# EAGLE design RC_Transmitter_TX_FINAL_v43 (EAGLE 9.6.2)
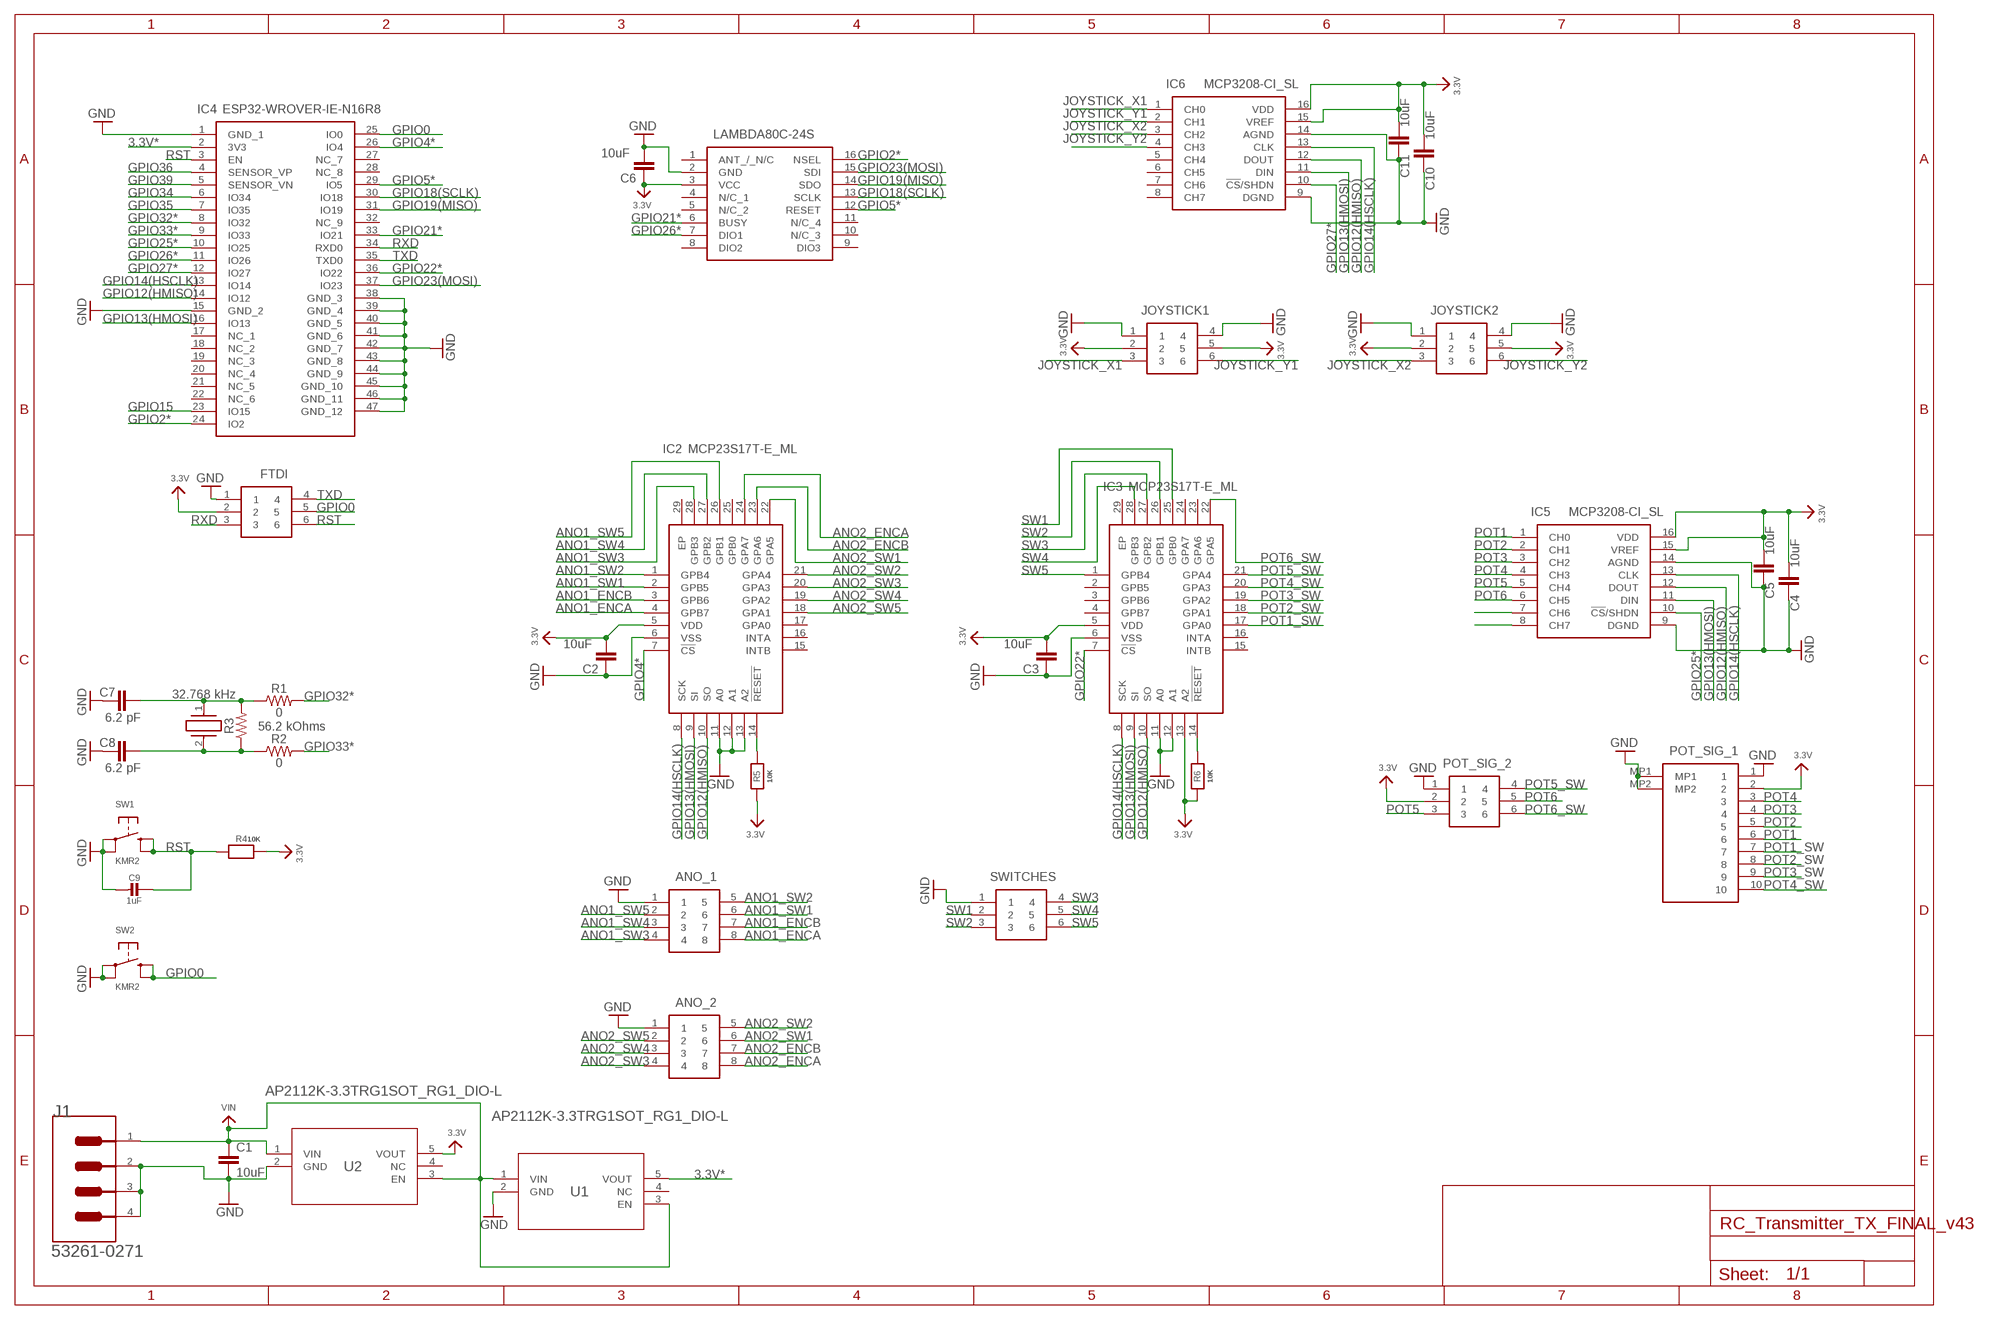
[diagram p0: schematic, sheet 1]

## Parts
ANO_1  0532610871  [53261-0871]
ANO_2  0532610871  [53261-0871]
C1  10uF  10UF-0805-10V-10%  [0805]
C2  10uF  10UF-0805-10V-10%  [0805]
C3  10uF  10UF-0805-10V-10%  [0805]
C4  10uF  10UF-0805-10V-10%  [0805]
C5  10uF  10UF-0805-10V-10%  [0805]
C6  10uF  10UF-0805-10V-10%  [0805]
C7  6.2 pF  C_CHIP-0805(2012-METRIC)  [CAPC2012X110]
C8  6.2 pF  C_CHIP-0805(2012-METRIC)  [CAPC2012X110]
C9  1uF  CAP_CERAMIC0805-NOOUTLINE  [0805-NO]
C10  10uF  10UF-0805-10V-10%  [0805]
C11  10uF  10UF-0805-10V-10%  [0805]
CRYSTAL  32.768 kHz  ECX-.327-CDX-1293  [ECX327CDX1293]
FTDI  0532610671  [0532610671]
IC1  LAMBDA80C-24S  [LAMBDA80C24S]
IC2  MCP23S17T-E_ML  [QFN65P600X600X100-29N]
IC3  MCP23S17T-E_ML  [QFN65P600X600X100-29N]
IC4  ESP32-WROVER-IE-N16R8  [ESP32WROVERIEN16R8]
IC5  MCP3208-CI_SL  [SOIC127P600X175-16N]
IC6  MCP3208-CI_SL  [SOIC127P600X175-16N]
J1  MOLEX_53261-0271MOLEX_53261-0271_0_0  [MOLEX_53261-0271_0]
JOYSTICK1  0532610671  [0532610671]
JOYSTICK2  0532610671  [0532610671]
POT_SIG_1  0532611071  [0532611071]
POT_SIG_2  0532610671  [0532610671]
R1  0  0OHM-0603-1/10W-5%  [0603]
R2  0  0OHM-0603-1/10W-5%  [0603]
R3  56.2 kOhms  0OHM-0603-1/10W-5%  [0603]
R4  10K  RESISTOR_0805  [_0805]
R5  10K  RESISTOR_0805  [_0805]
R6  10K  RESISTOR_0805  [_0805]
SW1  KMR2  SWITCH_TACT_SMT4.6X2.8  [BTN_KMR2_4.6X2.8]
SW2  KMR2  SWITCH_TACT_SMT4.6X2.8  [BTN_KMR2_4.6X2.8]
SWITCHES  0532610671  [0532610671]
U1  AP2112K-3.3TRG1SOT_RG1_DIO-L  [SOT_RG1_DIO-L]
U2  AP2112K-3.3TRG1SOT_RG1_DIO-L  [SOT_RG1_DIO-L]

## Nets
3.3V: C2.2 C3.2 C4.2 C5.2 C6.1 C10.2 C11.2 FTDI.2 IC1.3(VCC) IC2.5(VDD) IC3.5(VDD) IC3.13(A2) IC5.15(VREF) IC5.16(VDD) IC6.15(VREF) IC6.16(VDD) JOYSTICK1.2 JOYSTICK1.5 JOYSTICK2.2 JOYSTICK2.5 POT_SIG_1.2 POT_SIG_2.2 R4.2 R5.1 R6.1 U2.5(VOUT)
3.3V*: IC4.2(3V3) U1.5(VOUT)
ANO1_ENCA: ANO_1.8 IC2.4(GPB7)
ANO1_ENCB: ANO_1.7 IC2.3(GPB6)
ANO1_SW1: ANO_1.6 IC2.2(GPB5)
ANO1_SW2: ANO_1.5 IC2.1(GPB4)
ANO1_SW3: ANO_1.4 IC2.28(GPB3)
ANO1_SW4: ANO_1.3 IC2.27(GPB2)
ANO1_SW5: ANO_1.2 IC2.26(GPB1)
ANO2_ENCA: ANO_2.8 IC2.24(GPA7)
ANO2_ENCB: ANO_2.7 IC2.23(GPA6)
ANO2_SW1: ANO_2.6 IC2.22(GPA5)
ANO2_SW2: ANO_2.5 IC2.21(GPA4)
ANO2_SW3: ANO_2.4 IC2.20(GPA3)
ANO2_SW4: ANO_2.3 IC2.19(GPA2)
ANO2_SW5: ANO_2.2 IC2.18(GPA1)
GND: ANO_1.1 ANO_2.1 C1.2 C2.1 C3.1 C4.1 C5.1 C6.2 C7.1 C8.1 C9.2 C10.1 C11.1 FTDI.1 IC1.2(GND) IC2.6(VSS) IC2.11(A0) IC2.12(A1) IC2.13(A2) IC3.6(VSS) IC3.11(A0) IC3.12(A1) IC4.1(GND_1) IC4.15(GND_2) IC4.38(GND_3) IC4.39(GND_4) IC4.40(GND_5) IC4.41(GND_6) IC4.42(GND_7) IC4.43(GND_8) IC4.44(GND_9) IC4.45(GND_10) IC4.46(GND_11) IC4.47(GND_12) IC5.9(DGND) IC5.14(AGND) IC6.9(DGND) IC6.14(AGND) J1.2 J1.3(MNT_1) J1.4(MNT_2) JOYSTICK1.1 JOYSTICK1.4 JOYSTICK2.1 JOYSTICK2.4 POT_SIG_1.1 POT_SIG_1.MP1 POT_SIG_1.MP2 POT_SIG_2.1 SW1.A'(P1) SW1.A(P) SW2.A'(P1) SW2.A(P) SWITCHES.1 U1.2(GND) U2.2(GND)
GPIO0: FTDI.5 IC4.25(IO0) SW2.B'(S1) SW2.B(S)
GPIO2*: IC1.16(NSEL) IC4.24(IO2)
GPIO4*: IC2.7(!CS) IC4.26(IO4)
GPIO5*: IC1.12(RESET) IC4.29(IO5)
GPIO12(HMISO): IC2.10(SO) IC3.10(SO) IC4.14(IO12) IC5.12(DOUT) IC6.12(DOUT)
GPIO13(HMOSI): IC2.9(SI) IC3.9(SI) IC4.16(IO13) IC5.11(DIN) IC6.11(DIN)
GPIO14(HSCLK): IC2.8(SCK) IC3.8(SCK) IC4.13(IO14) IC5.13(CLK) IC6.13(CLK)
GPIO15: IC4.23(IO15)
GPIO18(SCLK): IC1.13(SCLK) IC4.30(IO18)
GPIO19(MISO): IC1.14(SDO) IC4.31(IO19)
GPIO21*: IC1.6(BUSY) IC4.33(IO21)
GPIO22*: IC3.7(!CS) IC4.36(IO22)
GPIO23(MOSI): IC1.15(SDI) IC4.37(IO23)
GPIO25*: IC4.10(IO25) IC5.10(!CS!/SHDN)
GPIO26*: IC1.7(DIO1) IC4.11(IO26)
GPIO27*: IC4.12(IO27) IC6.10(!CS!/SHDN)
GPIO32*: IC4.8(IO32) R1.2
GPIO33*: IC4.9(IO33) R2.2
GPIO34: IC4.6(IO34)
GPIO35: IC4.7(IO35)
GPIO36: IC4.4(SENSOR_VP)
GPIO39: IC4.5(SENSOR_VN)
JOYSTICK_X1: IC6.1(CH0) JOYSTICK1.3
JOYSTICK_X2: IC6.3(CH2) JOYSTICK2.3
JOYSTICK_Y1: IC6.2(CH1) JOYSTICK1.6
JOYSTICK_Y2: IC6.4(CH3) JOYSTICK2.6
N$1: C7.2 CRYSTAL.1(X1) R1.1 R3.2
N$2: C8.2 CRYSTAL.2(X2) R2.1 R3.1
N$4: IC2.14(!RESET) R5.2
N$5: IC3.14(!RESET) R6.2
N$9: IC5.7(CH6)
N$10: IC5.8(CH7)
POT1: IC5.1(CH0) POT_SIG_1.6
POT1_SW: IC3.17(GPA0) POT_SIG_1.7
POT2: IC5.2(CH1) POT_SIG_1.5
POT2_SW: IC3.18(GPA1) POT_SIG_1.8
POT3: IC5.3(CH2) POT_SIG_1.4
POT3_SW: IC3.19(GPA2) POT_SIG_1.9
POT4: IC5.4(CH3) POT_SIG_1.3
POT4_SW: IC3.20(GPA3) POT_SIG_1.10
POT5: IC5.5(CH4) POT_SIG_2.3
POT5_SW: IC3.21(GPA4) POT_SIG_2.4
POT6: IC5.6(CH5) POT_SIG_2.5
POT6_SW: IC3.22(GPA5) POT_SIG_2.6
RST: C9.1 FTDI.6 IC4.3(EN) R4.1 SW1.B'(S1) SW1.B(S)
RXD: FTDI.3 IC4.34(RXD0)
SW1: IC3.25(GPB0) SWITCHES.2
SW2: IC3.26(GPB1) SWITCHES.3
SW3: IC3.27(GPB2) SWITCHES.4
SW4: IC3.28(GPB3) SWITCHES.5
SW5: IC3.1(GPB4) SWITCHES.6
TXD: FTDI.4 IC4.35(TXD0)
VIN: C1.1 J1.1 U1.1(VIN) U1.3(EN) U2.1(VIN) U2.3(EN)
Unconnected: IC1.1(ANT_/_N/C) IC1.4(N/C_1) IC1.5(N/C_2) IC1.8(DIO2) IC1.9(DIO3) IC1.10(N/C_3) IC1.11(N/C_4) IC2.15(INTB) IC2.16(INTA) IC2.17(GPA0) IC2.25(GPB0) IC2.29(EP) IC3.2(GPB5) IC3.3(GPB6) IC3.4(GPB7) IC3.15(INTB) IC3.16(INTA) IC3.23(GPA6) IC3.24(GPA7) IC3.29(EP) IC4.17(NC_1) IC4.18(NC_2) IC4.19(NC_3) IC4.20(NC_4) IC4.21(NC_5) IC4.22(NC_6) IC4.27(NC_7) IC4.28(NC_8) IC4.32(NC_9) IC6.5(CH4) IC6.6(CH5) IC6.7(CH6) IC6.8(CH7) U1.4(NC) U2.4(NC)

## Library data of the parts
ANO_1 ANO_2 = 0532610871:0532610871: CONN HEADER 8POS 1.25MM R/A SMD Source: Datasheet <https://www.molex.com/pdm_docs/sd/532610871_sd.pdf>; ARROW_PART_NUMBER: 0532610871; ARROW_PRICE-STOCK: https://www.arrow.com/en/products/0532610871/molex?region=europe; DESCRIPTION: CONN HEADER 8POS 1.25MM R/A SMD; HEIGHT: mm; MANUFACTURER_NAME: Molex; MANUFACTURER_PART_NUMBER: 0532610871; MOUSER_PART_NUMBER: N/A; MOUSER_PRICE-STOCK: https://www.mouser.co.uk/ProductDetail/Molex/0532610871?qs=PBcRNPEHKspgmg1Yw%252BK1hQ%3D%3D
C1-C6 C10 C11 = SparkFun-Capacitors:10UF: 10.0µF ceramic capacitors A capacitor is a passive two-terminal electrical component used to store electrical energy temporarily in an electric field.; PROD_ID: CAP-11330
C7 C8 = Capacitor:C: Capacitor - Generic; CATEGORY: Capacitor
C9 = microbuilder:CAP_CERAMIC: Ceramic Capacitors For new designs, use the packages preceded by an '_' character since they are more reliable: The following footprints should be used on most boards: _0402 - Standard footprint for regular board layouts _0603 - Standard footprint for regular board layouts _0805 - Standard footprint for regular board layouts _1206 - Standard footprint for regular board layouts For extremely tight-pitch boards where space is at a premium, the following 'micro-pitch' footprints can be used (smaller pads, no silkscreen outline, etc.): _0402MP - Micro-pitch footprint for very dense/compact boards _0603MP - Micro-pitch footprint for very dense/compact boards _0805MP - Micro-pitch footprint for very dense/compact boards _1206MP - Micro-pitch footprint for very dense/compact boards
CRYSTAL = ECX-.327-CDX-1293:ECX-.327-CDX-1293: Crystals 32.786kHz 12.5pF 5ppm -40C +85C Source: Datasheet <https://www.ecsxtal.com/store/pdf/ECS-.327-CDX-1293.pdf>; ARROW_PART_NUMBER: Crystal; ARROW_PRICE-STOCK: https://www.arrow.com/en/products/ecx-.327-cdx-1293/ecs-international?region=nac; DESCRIPTION: Crystals 32.786kHz 12.5pF 5ppm -40C +85C; HEIGHT: 0.9mm; MANUFACTURER_NAME: ECS; MANUFACTURER_PART_NUMBER: ECX-.327-CDX-1293; MOUSER_PART_NUMBER: 520-ECX-.327CDX-1293; MOUSER_PRICE-STOCK: https://www.mouser.co.uk/ProductDetail/ECS/ECX-.327-CDX-1293?qs=Mv7BduZupUhhIpiFqP8JVA%3D%3D
FTDI JOYSTICK1 JOYSTICK2 POT_SIG_2 SWITCHES = 0532610671:0532610671: 1.25mm Pitch PicoBlade Header, Surface Mount, Right Angle, 6 Circuits Source: Datasheet <http://www.molex.com/webdocs/datasheets/pdf/en-us//0532610671_PCB_HEADERS.pdf>; ARROW_PART_NUMBER: 0532610671; ARROW_PRICE-STOCK: https://www.arrow.com/en/products/0532610671/molex?region=europe; DESCRIPTION: 1.25mm Pitch PicoBlade Header, Surface Mount, Right Angle, 6 Circuits; HEIGHT: mm; MANUFACTURER_NAME: Molex; MANUFACTURER_PART_NUMBER: 0532610671; MOUSER_PART_NUMBER: N/A; MOUSER_PRICE-STOCK: https://www.mouser.co.uk/ProductDetail/Molex/0532610671?qs=PBcRNPEHKspfA5Wux0sJoA%3D%3D
IC1 = LAMBDA80C-24S:LAMBDA80C-24S: RF Transceiver FSK 3.3V 16-Pin SMD Module Source: Datasheet <https://www.arrow.com/en/products/lambda80c-24s/rf-solutions>; ARROW_PART_NUMBER: LAMBDA80C-24S; ARROW_PRICE-STOCK: https://www.arrow.com/en/products/lambda80c-24s/rf-solutions; DESCRIPTION: RF Transceiver FSK 3.3V 16-Pin SMD Module; HEIGHT: 2mm; MANUFACTURER_NAME: RF SOLUTIONS; MANUFACTURER_PART_NUMBER: LAMBDA80C-24S; MOUSER_PART_NUMBER: 223-LAMBDA80C-24S; MOUSER_PRICE-STOCK: https://www.mouser.co.uk/ProductDetail/RF-Solutions/LAMBDA80C-24S?qs=17u8i%2FzlE89dhjIrlJ9FHg%3D%3D
IC2 IC3 = MCP23S17T-E_ML:MCP23S17T-E_ML: Interface - I/O Expanders 16bit Input/Output Exp SPI interface Source: Datasheet <https://mouser.componentsearchengine.com/Datasheets/2/MCP23S17T-E_ML.pdf>; ARROW_PART_NUMBER: MCP23S17T-E/ML; ARROW_PRICE-STOCK: https://www.arrow.com/en/products/mcp23s17t-eml/microchip-technology?region=nac; DESCRIPTION: Interface - I/O Expanders 16bit Input/Output Exp SPI interface; HEIGHT: 1mm; MANUFACTURER_NAME: Microchip; MANUFACTURER_PART_NUMBER: MCP23S17T-E/ML; MOUSER_PART_NUMBER: 579-MCP23S17T-E/ML; MOUSER_PRICE-STOCK: https://www.mouser.co.uk/ProductDetail/Microchip-Technology-Atmel/MCP23S17T-E-ML?qs=usxtMOJb1RyrYiIch4BqxQ%3D%3D
IC4 = ESP32-Wrover-IE-N16R8:ESP32-WROVER-IE-N16R8: RX TXRX MOD WIFI EXT IPEX SMD Source: Datasheet <https://www.espressif.com/sites/default/files/documentation/esp32-wrover-e_esp32-wrover-ie_datasheet_en.pdf>; DESCRIPTION: RX TXRX MOD WIFI EXT IPEX SMD; HEIGHT: 3.45mm; MANUFACTURER_NAME: Espressif Systems; MANUFACTURER_PART_NUMBER: ESP32-Wrover-IE-N16R8; MOUSER_PART_NUMBER: 356-ESP32WRVIE2864UC; MOUSER_PRICE-STOCK: https://www.mouser.co.uk/ProductDetail/Espressif-Systems/ESP32-WROVER-IE-N16R8?qs=Li%252BoUPsLEnvfUqsrs3zskw%3D%3D
IC5 IC6 = MCP3208-CI_SL:MCP3208-CI_SL: 12bit A-Dconverter,MCP3208-CI/SL TSSOP16 Source: Datasheet <http://ww1.microchip.com/downloads/en/DeviceDoc/21298e.pdf>; ARROW_PART_NUMBER: MCP3208-CI/SL; ARROW_PRICE-STOCK: https://www.arrow.com/en/products/mcp3208-cisl/microchip-technology?region=nac; DESCRIPTION: 12bit A-Dconverter,MCP3208-CI/SL TSSOP16; HEIGHT: 1.75mm; MANUFACTURER_NAME: Microchip; MANUFACTURER_PART_NUMBER: MCP3208-CI/SL; MOUSER_PART_NUMBER: 579-MCP3208CISL; MOUSER_PRICE-STOCK: https://www.mouser.co.uk/ProductDetail/Microchip-Technology-Atmel/MCP3208-CI-SL?qs=BYQkrObauitTKFi1HLZPqw%3D%3D
J1 = Molex - 53261-0271:MOLEX_53261-0271: Headers & Wire Housings 1.25MM HDR 2 CKT Right-Angle; CENTROID_NOT_SPECIFIED: No; DATASHEET: http://www.molex.com/pdm_docs/sd/532610271_sd.pdf; DIGIKEY_DESCRIPTION: CONN HEADER 2POS 1.25MM R/A SMD; DIGIKEY_PART_NUMBER: WM7620CT-ND; LEAD_FREE: yes; MF: Molex; MOUSER_PART_NUMBER: 538-53261-0271; MPN: 53261-0271; PACKAGE: HDR02; PREFIX: J; ROHS: yes; TEMPERATURE_RANGE_HIGH: +85°C; TEMPERATURE_RANGE_LOW: -40°C
POT_SIG_1 = 0532611071:0532611071: Headers & Wire Housings 1.25MM HDR 10P RA SMT Source: Datasheet <https://www.molex.com/pdm_docs/sd/532611071_sd.pdf>; ARROW_PART_NUMBER: 0532611071; ARROW_PRICE-STOCK: https://www.arrow.com/en/products/0532611071/molex?region=europe; DESCRIPTION: Headers & Wire Housings 1.25MM HDR 10P RA SMT; HEIGHT: 3.4mm; MANUFACTURER_NAME: Molex; MANUFACTURER_PART_NUMBER: 0532611071; MOUSER_PART_NUMBER: N/A; MOUSER_PRICE-STOCK: https://www.mouser.co.uk/ProductDetail/Molex/0532611071?qs=PBcRNPEHKsrWtdQS0ObonQ%3D%3D
R1 R2 = SparkFun-Resistors:0OHM: 0Ω resistor A resistor is a passive two-terminal electrical component that implements electrical resistance as a circuit element. Resistors act to reduce current flow, and, at the same time, act to lower voltage levels within circuits. - Wikipedia; PROD_ID: RES-08609
R3 = SparkFun-Resistors:0OHM: 0Ω resistor A resistor is a passive two-terminal electrical component that implements electrical resistance as a circuit element. Resistors act to reduce current flow, and, at the same time, act to lower voltage levels within circuits. - Wikipedia; PROD_ID: RES-08609; VALUE: 0
R4-R6 = microbuilder:RESISTOR: Resistors For new designs, use the packages preceded by an '_' character since they are more reliable: The following footprints should be used on most boards: _0402 - Standard footprint for regular board layouts _0603 - Standard footprint for regular board layouts _0805 - Standard footprint for regular board layouts _1206 - Standard footprint for regular board layouts For extremely tight-pitch boards where space is at a premium, the following 'micro-pitch' footprints can be used (smaller pads, no silkscreen outline, etc.): _0402MP - Micro-pitch footprint for very dense/compact boards _0603MP - Micro-pitch footprint for very dense/compact boards _0805MP - Micro-pitch footprint for very dense/compact boards _1206MP - Micro-pitch footprint for very dense/compact boards
SW1 SW2 = microbuilder:SWITCH_TACT_SMT: SMT Tact Switches 6x6mm - Digikey: P12940SCT-ND KMR2 (4.6x2.8mm) - Digikey: 401-1426-1-ND EVQ-PQHB55 - Light Touch, 160GF (4.5x4.5mm) - Digikey: P8090SCT-ND KMT0 - KMT021 NGJ LHS (etc.) IP68/Waterproof - Digikey: CKN10289CT-ND
U1 U2 = 2023-03-07_19-05-44_Library:AP2112K-3.3TRG1; COPYRIGHT: Copyright (C) 2023 Ultra Librarian. All rights reserved.; MANUFACTURER_PART_NUMBER: AP2112K-3.3TRG1; MFR_NAME: Diodes Inc

## Board
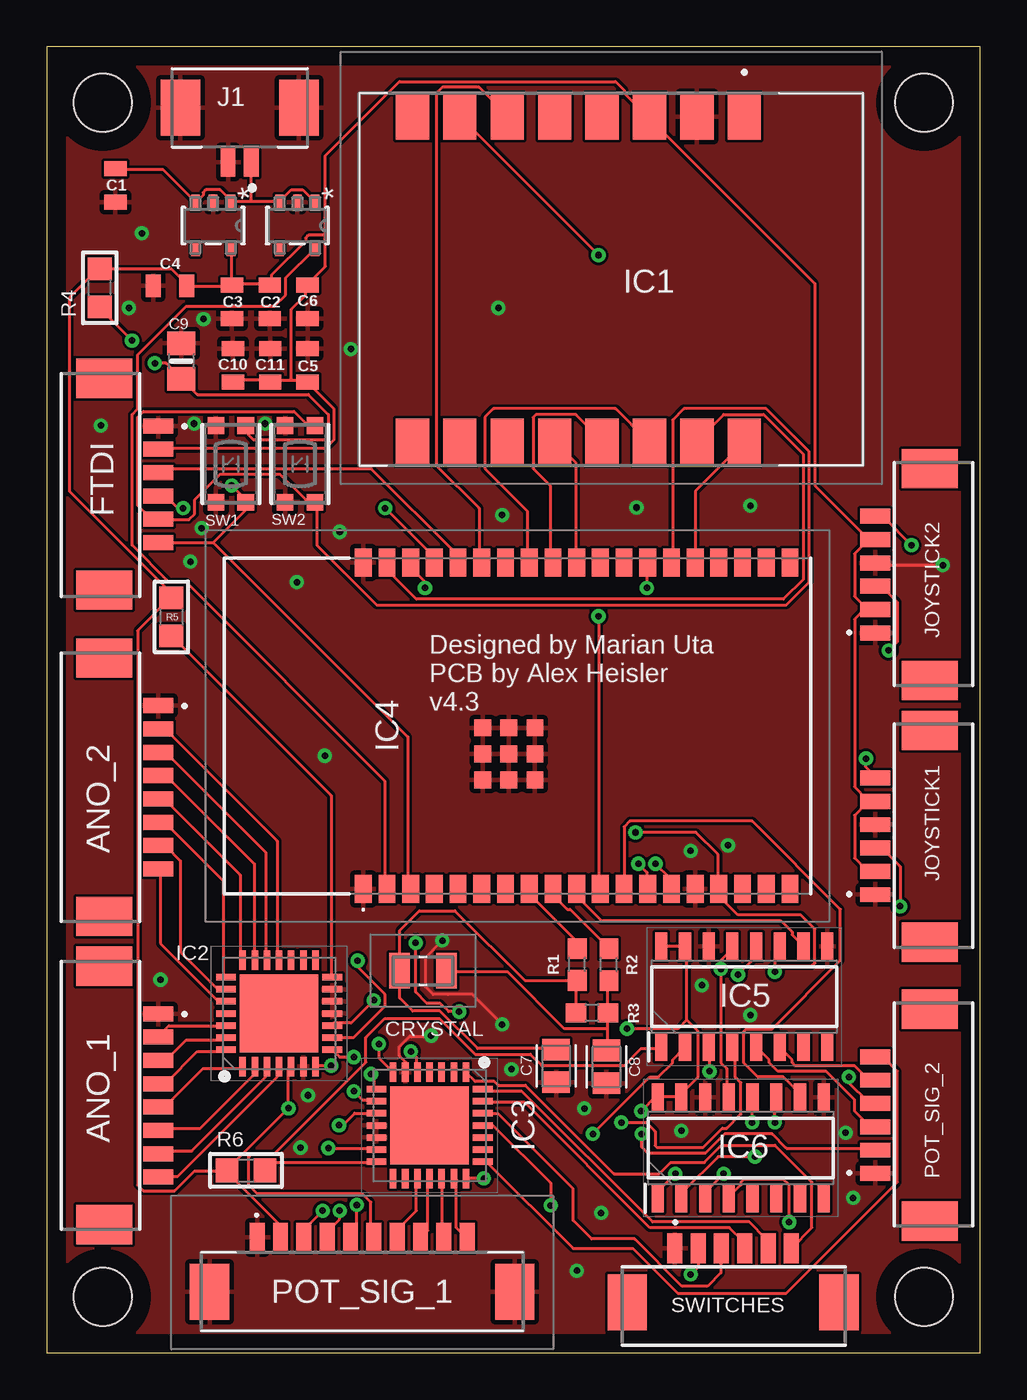
[diagram p1: board, top side]
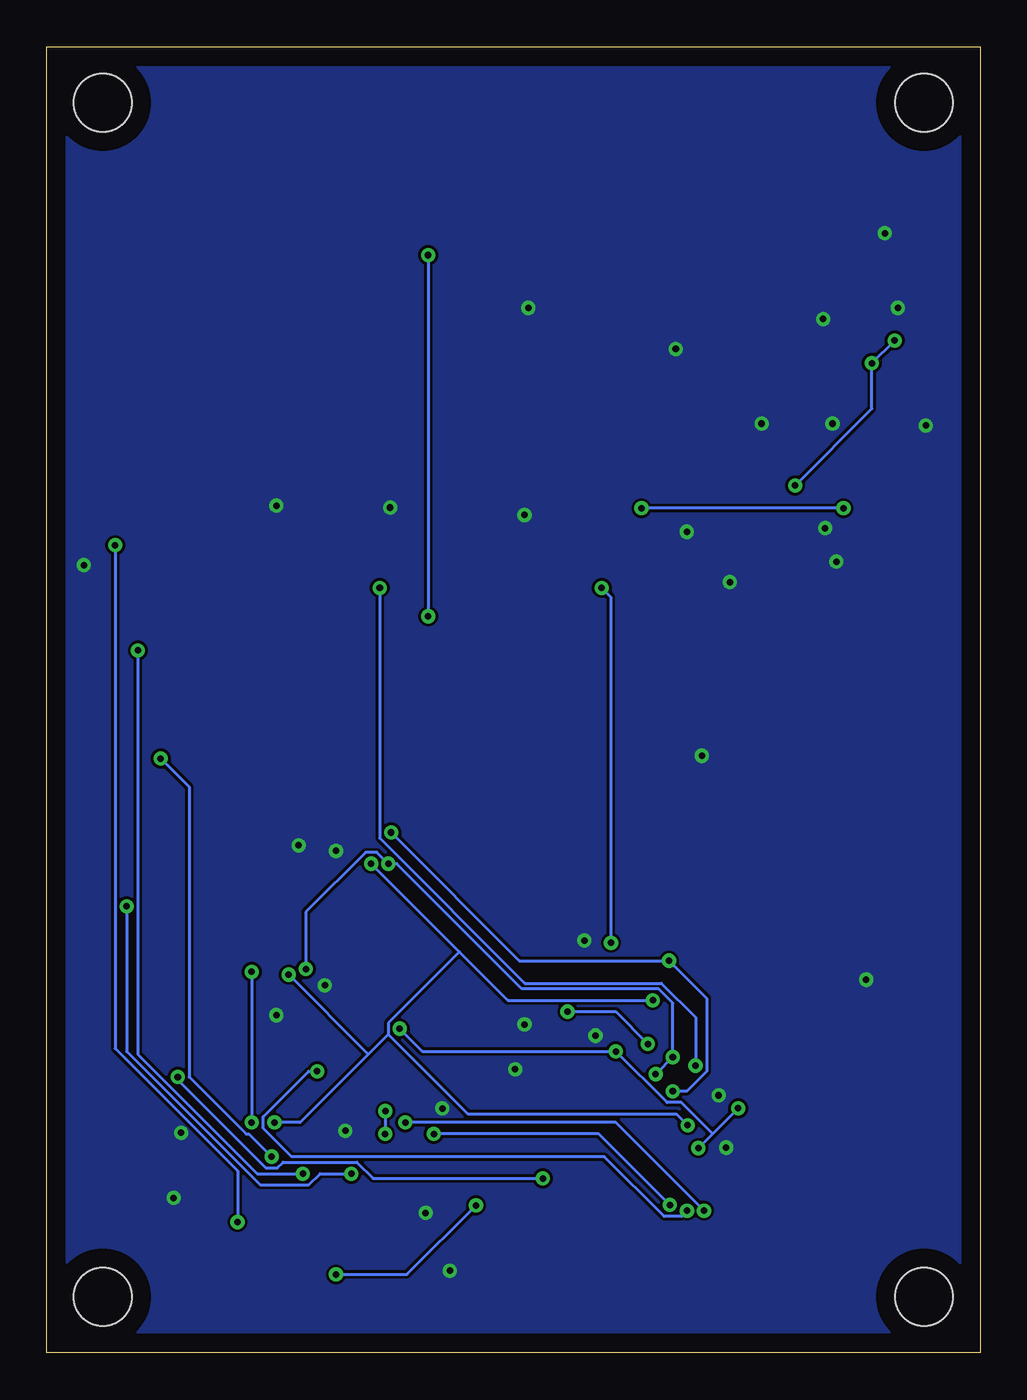
[diagram p2: board, bottom side, seen from below]

Size 50 x 70 mm. Coordinates in mm from the lower left corner, seen from the top.
Outline: 0,0 50,0 50,70 0,70 0,0
Copper layers (1*16): Top 0.035mm / dielectric 1.5mm / Bottom 0.035mm
Design rules "default": minimum track width 6mil, minimum drill 0.35mm, track to track 6mil, track to pad 6mil, pad to pad 6mil, via to via 6mil, smd to smd 6mil, copper to edge 40mil, drill to drill 6mil, minimum pad ring 10mil, minimum via ring 8mil, stop-mask expansion 4mil, vias tented up to drill 0mil, thermal gap 10mil
Holes 3.1 mm at 3,3 47,3 47,67 3,67

### Footprints (pad centres in the part's own frame; a part is rotated, then mirrored left to right if it is on the bottom)
53261-0871 = smd 0.8 x 1.6: 1 -4.375,1.004; 2 -3.125,1.004; 3 -1.875,1.004; 4 -0.625,1.004; 5 0.625,1.004; 6 1.875,1.004; 7 3.125,1.004; 8 4.375,1.004 | smd 2.1 x 3: 9 6.925,-1.896; 10 -6.925,-1.896
0805 = smd 0.8 x 1.2: 1 -0.9,0; 2 0.9,0
CAPC2012X110 = smd 1.165 x 1.465: 1 -0.875,0; 2 0.875,0
0805-NO = smd 1.24 x 1.5: 1 -0.95,0; 2 0.95,0
ECX327CDX1293 = smd 1.1 x 1.9: 1 -1.25,0; 2 1.25,0
0532610671 = smd 0.8 x 1.6: 1 -3.125,1.004; 2 -1.875,1.004; 3 -0.625,1.004; 4 0.625,1.004; 5 1.875,1.004; 6 3.125,1.004 | smd 2.1 x 3: 7 -5.675,-1.896; 8 5.675,-1.896
LAMBDA80C24S = smd 2.5 x 1.78: 1 -8.725,7.135; 2 -8.725,4.595; 3 -8.725,2.055; 4 -8.725,-0.485; 5 -8.725,-3.025; 6 -8.725,-5.565; 7 -8.725,-8.105; 8 -8.725,-10.645; 9 8.725,-10.645; 10 8.725,-8.105; 11 8.725,-5.565; 12 8.725,-3.025; 13 8.725,-0.485; 14 8.725,2.055; 15 8.725,4.595; 16 8.725,7.135
QFN65P600X600X100-29N = smd 1.05 x 0.35: 1 -2.85,1.95; 2 -2.85,1.3; 3 -2.85,0.65; 4 -2.85,0; 5 -2.85,-0.65; 6 -2.85,-1.3; 7 -2.85,-1.95; 15 2.85,-1.95; 16 2.85,-1.3; 17 2.85,-0.65; 18 2.85,0; 19 2.85,0.65; 20 2.85,1.3; 21 2.85,1.95 | smd 0.35 x 1.05: 8 -1.95,-2.85; 9 -1.3,-2.85; 10 -0.65,-2.85; 11 0,-2.85; 12 0.65,-2.85; 13 1.3,-2.85; 14 1.95,-2.85; 22 1.95,2.85; 23 1.3,2.85; 24 0.65,2.85; 25 0,2.85; 26 -0.65,2.85; 27 -1.3,2.85; 28 -1.95,2.85 | smd 4.2 x 4.2: 29 0,0
ESP32WROVERIEN16R8 = smd 1.5 x 0.9: 1 -8.75,8.26; 2 -8.75,6.99; 3 -8.75,5.72; 4 -8.75,4.45; 5 -8.75,3.18; 6 -8.75,1.91; 7 -8.75,0.64; 8 -8.75,-0.63; 9 -8.75,-1.9; 10 -8.75,-3.17; 11 -8.75,-4.44; 12 -8.75,-5.71; 13 -8.75,-6.98; 14 -8.75,-8.25; 15 -8.75,-9.52; 16 -8.75,-10.79; 17 -8.75,-12.06; 18 -8.75,-13.33; 19 -8.75,-14.6; 20 8.75,-14.6; 21 8.75,-13.33; 22 8.75,-12.06; 23 8.75,-10.79; 24 8.75,-9.52; 25 8.75,-8.25; 26 8.75,-6.98; 27 8.75,-5.71; 28 8.75,-4.44; 29 8.75,-3.17; 30 8.75,-1.9; 31 8.75,-0.63; 32 8.75,0.64; 33 8.75,1.91; 34 8.75,3.18; 35 8.75,4.45; 36 8.75,5.72; 37 8.75,6.99; 38 8.75,8.26 | smd 0.9 x 0.9: 39 -1.5,0.46; 40 -1.5,1.86; 41 -2.9,1.86; 42 -2.9,0.46; 43 -2.9,-0.94; 44 -1.5,-0.94; 45 -0.1,-0.94; 46 -0.1,0.46; 47 -0.1,1.86
SOIC127P600X175-16N = smd 1.5 x 0.65: 1 -2.7,4.445; 2 -2.7,3.175; 3 -2.7,1.905; 4 -2.7,0.635; 5 -2.7,-0.635; 6 -2.7,-1.905; 7 -2.7,-3.175; 8 -2.7,-4.445; 9 2.7,-4.445; 10 2.7,-3.175; 11 2.7,-1.905; 12 2.7,-0.635; 13 2.7,0.635; 14 2.7,1.905; 15 2.7,3.175; 16 2.7,4.445
MOLEX_53261-0271_0 = smd 0.8 x 1.6: 1 -0.625,2.9; 2 0.625,2.9 | smd 2.1 x 3: 3 -3.175,0; 4 3.175,0
0532611071 = smd 0.8 x 1.6: 1 -5.625,2.9; 2 -4.375,2.9; 3 -3.125,2.9; 4 -1.875,2.9; 5 -0.625,2.9; 6 0.625,2.9; 7 1.875,2.9; 8 3.125,2.9; 9 4.375,2.9; 10 5.625,2.9 | smd 2.1 x 3: MP1 -8.175,0; MP2 8.175,0
0603 = smd 1.1 x 1: 1 -0.85,0; 2 0.85,0
_0805 = smd 1.2 x 1.3: 1 -1.016,0; 2 1.016,0
BTN_KMR2_4.6X2.8 = smd 0.9 x 0.9: A 2.05,0.8; A' -2.05,0.8; B 2.05,-0.8; B' -2.05,-0.8
SOT_RG1_DIO-L = smd 0.8 x 0.457: 1 -1.251,0.95; 2 -1.251,0; 3 -1.251,-0.95; 4 1.251,-0.95; 5 1.251,0.95

### Placement (x,y rotation side)
ANO_1  4.98,13.8 270 top
ANO_2  4.98,30.31 270 top
C1  3.68,62.56 270 top
C2  11.95,56.32 90 top
C3  9.92,56.32 90 top
C4  6.61,57.18 0 top
C5  13.98,52.91 270 top
C6  13.98,56.32 270 top
C7  27.29,15.38 90 top
C8  29.99,15.33 90 top
C9  7.22,53.15 90 top
C10  9.98,52.91 270 top
C11  11.98,52.91 270 top
CRYSTAL  20.16,20.48 0 top
FTDI  4.98,46.55 270 top
IC1  30.24,57.53 270 top
IC2  12.45,18.19 90 top
IC3  20.51,12.19 270 top
IC4  25.22,33.6 90 top
IC5  37.37,19.09 90 top
IC6  37.18,10.98 90 top
J1  10.34,66.72 180 top
JOYSTICK1  45.4,27.68 90 top
JOYSTICK2  45.4,41.71 90 top
POT_SIG_1  16.9,3.28 0 top
POT_SIG_2  45.4,12.74 90 top
R1  28.42,20.81 90 top
R2  30.12,20.8 90 top
R3  29.21,18.22 180 top
R4  2.84,57.08 90 top
R5  6.68,39.44 270 top
R6  10.68,9.78 0 top
SW1  9.87,47.63 90 top
SW2  13.57,47.63 90 top
SWITCHES  36.77,4.6 0 top
U1  13.43,60.41 270 top
U2  8.92,60.41 270 top

### Tracks (layer width: path | path; a pad name or v marks a point on that pad's centre or on a via)
3.3V  (via drill 0.35)
  Top 0.152: IC2.5 12.95,15.24 v12.95,13.11 9.75,9.91 R6.1 9.6,9.75 | v15.09,10.97 17.53,10.97 IC3.13 | v19.51,16.15 19.81,15.85 19.81,15.09 IC3.5 | 9.6,9.75 12.5,6.86 12.5,6.25 POT_SIG_1.2 | IC5.16 33.07,21.79 34.14,21.79 IC5.15 34.29,21.64 34.29,17.83 | 33.83,13.72 33.98,13.72 IC6.15 33.83,13.72 | 33.83,13.72 32.77,13.72 IC6.16 32.61,13.72 v31.85,12.95 | POT_SIG_2.2 44.35,10.97 39.62,10.97 38.86,11.73 36.32,11.73 35.29,10.7 32.2,10.7 31.87,11.03 v31.87,11.73 | 34.29,17.83 34.9,17.22 34.9,14.78 33.83,13.72 | v31.09,17.37 33.83,17.37 34.29,17.83 | U2.5 9.91,59.13 9.91,57.3 C3.2 | C3.2 9.91,57.15 7.62,57.15 C4.2 7.47,57.3 6.71,58.06 2.9,58.06 R4.2 2.74,58.06 1.22,56.54 1.22,46.18 6.55,40.84 6.55,40.54 R5.1 6.55,40.39 4.88,38.71 4.88,8.99 5.18,8.69 6.86,8.69 7.92,9.75 9.6,9.75 | C3.2 10.06,57.3 11.89,57.3 C2.2 12.04,57.3 12.04,57.76 13.87,59.59 13.87,59.74 14.02,59.89 14.94,59.89 | 43.89,29.41 43.28,28.8 43.28,26.52 43.89,25.91 44.35,25.91 JOYSTICK1.2 | 43.89,29.41 44.35,29.41 JOYSTICK1.5 43.89,29.41 | 43.89,39.93 44.35,39.93 JOYSTICK2.2 43.89,39.93 | 43.89,39.93 43.28,40.54 43.28,42.82 43.89,43.43 | 43.89,43.43 44.35,43.43 JOYSTICK2.5 43.89,43.43 | 43.89,29.41 43.89,29.72 43.28,30.33 43.28,39.32 43.89,39.93 | C10.2 10.06,52.12 11.89,52.12 C11.2 12.04,52.12 13.11,52.12 | 13.11,52.12 13.87,52.12 C5.2 14.02,51.97 15.39,50.6 15.39,48.92 14.94,48.46 6.1,48.46 FTDI.2 | 13.11,52.12 13.11,55.93 13.87,56.69 13.87,57.15 C6.1 14.02,57.3 14.94,58.22 14.94,59.89 | 14.94,59.89 14.94,64.16 18.9,68.12 30.48,68.12 30.94,67.67 30.94,67.51 32.16,66.29 IC1.3 32.31,66.14 41.15,57.3 41.15,46.48 43.89,43.74 43.89,43.43
  Bottom 0.152: v12.95,13.11 14.33,11.73 | 14.33,11.73 v15.09,10.97 | 14.33,11.73 16,13.41 16.76,13.41 v19.51,16.15 29.87,16.15 v31.09,17.37 | v31.87,11.73 31.85,11.75 v31.85,12.95
3.3V*
  Top 0.152: U1.5 14.33,59.13 12.8,57.61 12.8,56.69 12.19,56.08 7.47,56.08 4.88,53.49 4.88,50.6 4.57,50.29 4.57,43.28 6.55,41.3 7.47,41.3 18.14,30.63 18.14,24.99 IC4.2
ANO1_ENCA
  Top 0.152: IC2.4 12.34,15.24 12.34,14.78 7.01,9.45 6.1,9.45 ANO_1.8
ANO1_ENCB
  Top 0.152: IC2.3 11.73,15.24 11.73,14.78 7.77,10.82 6.1,10.82 ANO_1.7
ANO1_SW1
  Top 0.152: IC2.2 11.12,15.24 11.12,14.94 8.23,12.04 6.1,12.04 ANO_1.6
ANO1_SW2
  Top 0.152: IC2.1 10.36,15.24 8.38,15.24 6.4,13.26 6.1,13.26 ANO_1.5
ANO1_SW3
  Top 0.152: IC2.28 9.45,16.15 8.08,16.15 6.4,14.48 6.1,14.48 ANO_1.4
ANO1_SW4
  Top 0.152: IC2.27 9.45,16.76 7.47,16.76 6.4,15.7 6.1,15.7 ANO_1.3
ANO1_SW5
  Top 0.152: IC2.26 9.45,17.53 6.55,17.53 6.1,17.07 ANO_1.2
ANO2_ENCA
  Top 0.152: IC2.24 9.45,18.9 9.14,18.9 6.1,21.95 6.1,25.91 ANO_2.8
ANO2_ENCB
  Top 0.152: IC2.23 9.45,19.51 9.14,19.51 7.16,21.49 7.16,26.36 6.4,27.13 6.1,27.13 ANO_2.7
ANO2_SW1
  Top 0.152: IC2.22 9.45,20.27 9.45,25.3 6.4,28.35 6.1,28.35 ANO_2.6
ANO2_SW2
  Top 0.152: IC2.21 10.36,21.18 10.36,25.6 6.4,29.57 6.1,29.57 ANO_2.5
ANO2_SW3
  Top 0.152: IC2.20 11.12,21.18 11.12,26.21 6.55,30.79 6.1,30.79 ANO_2.4
ANO2_SW4
  Top 0.152: IC2.19 11.73,21.18 11.73,26.82 6.4,32.16 6.1,32.16 ANO_2.3
ANO2_SW5
  Top 0.152: IC2.18 12.34,21.18 12.34,27.43 6.4,33.38 6.1,33.38 ANO_2.2
GND  (via drill 0.35)
  Top 0.152: v48.01,42.22 44.5,42.22 JOYSTICK2.4 | 34.75,24.23 IC4.15 | IC3.6 19.21,15.59 18.9,15.9 18.9,16.41 19.46,16.96 20.56,16.96 | v24.4,17.6 22.8,19.2 21.5,19.2 20.7,19.2 20.3,19.6 20.3,21.2 v21.2,22.1
  other vias: 24.2,56 8.4,55.4 5.1,60 7.9,49.8 11.7,49.8 2.9,49.7 7.7,42.4 24.4,44.9 31.6,45.3 37.7,45.4 36.5,27.2 4.4,56 15.7,44 13.4,41.3 8.3,44.2 14,13.8 6.1,20 13.6,11 20.6,17 28.8,13.1 29.7,7.5 28.4,4.4 43.2,8.3 42.8,11.8 34.5,26.9 35.1,19.7 37.7,18.1 24.9,15.2 14.9,32 34,11.9 16.3,53.8
  pour Top: 0,0 50,0 50,70 0,70
  pour Bottom: 0,0 50,0 50,70 0,70
GPIO0
  Top 0.152: SW2.B 14.33,49.84 13.87,49.84 13.26,50.44 5.18,50.44 4.88,50.14 4.88,45.41 5.49,44.81 5.94,44.81 FTDI.5 6.1,44.65 7.62,44.65 7.92,44.96 7.92,45.72 9.3,47.09 12.5,47.09 13.87,45.72 14.33,45.72 SW2.B' 14.48,45.57 14.48,43.28 17.68,40.08 39.62,40.08 40.84,41.3 40.84,48.31 38.56,50.6 34.14,50.6 33.53,49.99 33.53,42.37 IC4.25
GPIO2*
  Top 0.152: IC1.16 34.75,46.18 34.75,42.37 IC4.24
GPIO4*  (via drill 0.35)
  Top 0.152: v15.24,15.39 14.48,15.39 IC2.7 | v32.16,41 32.16,42.22 IC4.26
  Bottom 0.152: v15.24,15.39 15.24,17.98 17.07,19.81 24.38,19.81 32.16,27.58 v32.16,41
GPIO5*
  Top 0.152: IC4.29 28.35,42.37 28.35,47.7 27.28,48.77 IC1.12
GPIO12(HMISO)  (via drill 0.35)
  Top 0.152: v17.53,18.9 16.31,17.68 15.39,17.68 IC2.10 | v32.61,26.21 33.38,25.45 33.38,24.99 IC4.14 | v15.66,12.2 15.86,12.2 16.5,12.84 IC3.10 | v37.8,12.34 37.8,13.56 IC6.12 | v37.03,20.27 37.95,21.18 37.95,21.64 IC5.12
  Bottom 0.152: v17.53,18.9 25.3,18.9 27.89,21.49 | v32.61,26.21 27.89,21.49 | v15.66,12.2 16.26,12.8 27.43,12.8 31.7,17.07 | 31.7,17.07 31.7,17.68 27.89,21.49 | v37.8,12.34 36.42,12.34 32.77,16 | 31.7,17.07 32.77,16 | 32.77,16 v37.03,20.27
GPIO13(HMOSI)  (via drill 0.35)
  Top 0.152: v16.46,14.02 16.92,13.56 17.53,13.56 IC3.9 | v16.66,21.02 16.66,20.68 18.14,19.2 18.14,18.59 16.46,16.92 15.39,16.92 IC2.9 | v39.01,12.34 39.01,13.56 IC6.11 | 39.01,20.73 39.01,21.49 39.17,21.64 IC5.11 | 39.01,20.73 41,20.73 41.15,20.88 41.15,22.71 40.39,23.47 37.03,23.47 36.12,24.38 36.12,24.84 IC4.16 35.97,24.99 35.97,26.7 34.78,27.89 v31.55,27.89 | 39.01,20.73 v39.01,20.42
  Bottom 0.152: v16.46,14.02 15.7,14.02 14.63,15.09 14.63,18.99 v16.66,21.02 24.67,21.02 v31.55,27.89 | v39.01,20.42 v39.01,12.34
GPIO14(HSCLK)  (via drill 0.35)
  Top 0.152: IC6.13 36.42,13.72 36.42,15.24 36.12,15.54 v36.12,20.57 36.12,21.03 36.73,21.64 IC5.13 | v17.37,14.94 17.53,14.78 17.53,14.17 IC3.8 | v16.46,15.85 15.7,15.85 15.39,16.15 IC2.8 | v31.7,26.21 32.16,25.76 32.16,24.99 IC4.13
  Bottom 0.152: v17.37,14.94 v16.46,15.85 16.46,18.75 17.22,19.51 24.54,19.51 31.24,26.21 v31.7,26.21 32.31,26.82 32.92,26.82 36.12,23.62 v36.12,20.57
GPIO18(SCLK)
  Top 0.152: IC4.30 26.98,42.37 26.98,46.48 26.06,47.4 26.06,50.14 26.21,50.29 28.35,50.29 29.72,48.92 IC1.13
GPIO19(MISO)
  Top 0.152: IC4.31 25.76,42.37 25.76,45.11 23.47,47.4 23.47,50.14 23.93,50.6 30.48,50.6 32.16,48.92 IC1.14
GPIO21*
  Top 0.152: IC4.33 23.16,42.37 23.16,45.26 20.88,47.55 20.88,67.51 21.18,67.82 23.16,67.82 24.69,66.29 IC1.6
GPIO22*  (via drill 0.35)
  Top 0.152: v17.79,16.55 17.79,15.81 IC3.7 | v20.27,41 20.27,41.3 19.36,42.22 IC4.36 | v22.1,18.29 21.53,18.29 21.09,18.73 20.37,18.73 19.77,19.33 v19.77,21.98
  Bottom 0.152: v17.79,16.55 19.53,18.29 v22.1,18.29 | v20.27,41 19.77,40.5 v19.77,21.98
GPIO23(MOSI)
  Top 0.152: IC4.37 18.29,42.22 18.29,41.91 19.81,40.39 39.47,40.39 40.54,41.45 40.54,48.16 38.41,50.29 36.27,50.29 34.9,48.92 IC1.15
GPIO25*
  Top 0.152: IC5.10 39.93,22.4 39.93,22.55 39.32,23.16 29.72,23.16 28.5,24.38 28.5,24.84 IC4.10
GPIO26*  (via drill 0.35)
  Top 0.152: v29.57,39.47 29.57,24.99 IC4.11 | v29.57,58.83 22.25,66.14 IC1.7
  Bottom 0.152: v29.57,58.83 v29.57,39.47
GPIO27*
  Top 0.152: IC4.12 30.94,24.99 30.94,28.19 31.24,28.5 37.8,28.5 42.52,23.77 42.52,21.03 38.86,17.37 37.49,17.37 37.34,17.22 37.34,15.54 38.1,14.78 39.47,14.78 40.23,14.02 40.23,13.72 IC6.10
GPIO32*
  Top 0.152: R1.2 28.35,21.79 28.35,22.1 25.91,24.54 25.91,24.84 IC4.8
GPIO33*
  Top 0.152: R2.2 30.02,21.79 28.04,23.77 27.89,23.77 27.13,24.54 IC4.9
JOYSTICK_X1  (via drill 0.35)
  Top 0.152: v33.68,9.6 32.77,8.69 32.77,8.38 IC6.1 | v45.72,23.93 45.72,26.06 44.81,26.98 44.5,26.98 JOYSTICK1.3
  Bottom 0.152: v33.68,9.6 35.36,9.6 35.97,8.99 38.56,8.99 45.72,16.15 v45.72,23.93
JOYSTICK_X2  (via drill 0.35)
  Top 0.152: v36.27,9.6 35.36,8.69 35.36,8.38 IC6.3 | v45.11,37.64 45.57,38.1 45.57,40.23 44.81,41 44.5,41 JOYSTICK2.3
  Bottom 0.152: v36.27,9.6 38.71,9.6 45.11,16 v45.11,37.64
JOYSTICK_Y1  (via drill 0.35)
  Top 0.152: v37.95,10.52 35.97,10.52 34.14,8.69 34.14,8.38 IC6.2 | v43.89,31.85 43.89,31.39 44.35,30.94 JOYSTICK1.6
  Bottom 0.152: v37.95,10.52 39.17,11.73 39.32,11.73 42.37,14.78 42.37,30.33 v43.89,31.85
JOYSTICK_Y2  (via drill 0.35)
  Top 0.152: v39.78,7.01 39.78,8.99 39.47,9.3 37.34,9.3 37.19,9.14 37.19,8.99 36.58,8.38 IC6.4 | v46.33,43.28 44.81,44.81 44.5,44.81 JOYSTICK2.6
  Bottom 0.152: v39.78,7.01 39.78,9.75 46.33,16.31 v46.33,43.28
N$1
  Top 0.152: R3.2 28.35,18.29 28.35,19.81 R1.1 28.35,19.96 25.6,19.96 21.87,23.69 19.97,23.69 18.91,22.63 CRYSTAL.1 18.91,19.01 19.6,18.32 21.07,18.32 23.08,16.31 27.28,16.31 C7.2
N$2
  Top 0.152: R2.1 30.02,19.81 30.02,18.29 R3.1 30.02,18.14 30.02,17.37 | 30.02,17.37 30.02,16.31 C8.2 | 30.02,17.37 27.74,17.37 24.69,20.42 21.49,20.42 CRYSTAL.2
N$4
  Top 0.152: IC2.14 15.24,20.27 15.24,29.87 6.71,38.41 R5.2
N$5
  Top 0.152: IC3.14 17.53,10.21 12.04,10.21 11.73,9.91 R6.2
POT1
  Top 0.152: IC5.1 32.92,16.31 31.85,16.31 30.94,15.39 30.93,15.39 26.51,15.39 25.91,16 22.96,16 21.04,17.92 18.12,17.92 17.1,16.9 17.1,15.58 12.19,10.67 10.97,10.67 10.82,10.52 10.82,8.99 11.28,8.53 16.92,8.53 17.37,8.08 17.37,6.25 POT_SIG_1.6
POT1_SW
  Top 0.152: IC3.17 19.81,9.3 19.81,7.62 18.9,6.71 18.9,6.25 POT_SIG_1.7
POT2  (via drill 0.35)
  Top 0.152: v29.26,11.73 32.31,14.78 32.77,14.78 33.53,15.54 33.53,15.7 34.14,16.31 IC5.2 | v16.61,7.92 16.61,6.55 16.31,6.25 POT_SIG_1.5
  Bottom 0.152: v29.26,11.73 20.42,11.73 v16.61,7.92
POT2_SW
  Top 0.152: IC3.18 20.42,9.3 20.42,6.55 20.12,6.25 POT_SIG_1.8
POT3  (via drill 0.35)
  Top 0.152: v35.51,15.09 35.51,16.31 IC5.3 | v15.7,7.62 15.7,7.16 15.09,6.55 15.09,6.25 POT_SIG_1.4
  Bottom 0.152: v35.51,15.09 35.97,15.09 38.41,12.65 38.41,12.04 36.88,10.52 20.12,10.52 16.92,7.32 16,7.32 v15.7,7.62
POT3_SW
  Top 0.152: IC3.19 21.18,9.3 21.18,6.25 POT_SIG_1.9
POT4  (via drill 0.35)
  Top 0.152: v14.78,7.62 13.87,6.71 13.87,6.25 POT_SIG_1.3 | IC5.4 36.88,16.31 36.88,14.78 37.19,14.48 37.19,12.8 36.42,12.04 36.2,12.04 35.16,11.01 32.7,11.01 32.6,11.1 32.6,11.86 32.12,12.34 v30.79,12.34
  Bottom 0.152: v30.79,12.34 19.51,12.34 v14.78,7.62
POT4_SW
  Top 0.152: IC3.20 21.95,9.3 21.95,6.71 22.4,6.25 POT_SIG_1.10
POT5
  Top 0.152: IC5.5 38.1,16.31 38.71,15.7 38.71,15.54 39.17,15.09 41.76,15.09 43.28,13.56 43.28,12.95 44.04,12.19 44.35,12.19 POT_SIG_2.3
POT5_SW  (via drill 0.35)
  Top 0.152: v23.42,9.35 IC3.21 | v42.98,14.78 42.98,14.48 44.04,13.41 44.35,13.41 POT_SIG_2.4
  Bottom 0.152: v23.42,9.35 32.51,9.35 33.38,10.21 37.34,10.21 37.64,9.91 38.25,9.91 42.98,14.63 v42.98,14.78
POT6
  Top 0.152: IC5.6 39.32,16.31 39.93,15.7 39.93,15.54 40.08,15.39 43.28,15.39 44.04,14.63 44.35,14.63 POT_SIG_2.5
POT6_SW
  Top 0.152: POT_SIG_2.6 44.5,15.85 44.81,15.85 45.57,15.09 45.57,9.14 39.62,3.2 33.8,3.2 31.4,5.6 28.2,5.6 23.56,10.24 IC3.22
RST  (via drill 0.35)
  Top 0.152: SW1.B 10.82,49.68 10.82,49.19 11.09,48.92 14.94,48.92 15.09,49.07 15.09,50.29 14.02,51.36 8.08,51.36 7.32,52.12 C9.1 7.16,52.27 6.4,53.03 v5.79,53.03 | v4.57,54.25 2.9,55.93 R4.1 | 8.93,43.43 10.67,45.17 SW1.B' 10.67,45.72 v9.91,46.48 | 8.93,43.43 6.1,43.43 FTDI.6 | 8.93,43.43 19.36,33.01 19.36,24.99 IC4.3
  Bottom 0.152: v4.57,54.25 v5.79,53.03 5.79,50.6 v9.91,46.48
RXD
  Top 0.152: IC4.34 21.95,42.37 21.95,42.82 17.37,47.4 6.25,47.4 6.1,47.24 FTDI.3
SW1  (via drill 0.35)
  Top 0.152: IC3.25 23.91,12.19 27,9.1 v27,7.9 | SWITCHES.2 34.9,4.59 v34.5,4.2
  Bottom 0.152: v34.5,4.2 30.7,4.2 v27,7.9
SW2
  Top 0.152: IC3.26 23.47,12.8 24.2,12.8 28.2,8.8 28.2,7.1 29.2,6.1 31.5,6.1 34.03,3.57 35.41,3.57 36.12,4.28 36.12,5.49 SWITCHES.3
SW3
  Top 0.152: IC3.27 23.47,13.41 25.6,13.41 32.31,6.71 36.58,6.71 37.34,5.94 37.34,5.64 SWITCHES.4
SW4
  Top 0.152: IC3.28 23.47,14.02 25.45,14.02 32.46,7.01 37.64,7.01 38.56,6.1 38.56,5.64 SWITCHES.5
SW5
  Top 0.152: SWITCHES.6 39.93,5.64 41,6.71 41,9.14 39.01,11.12 36.15,11.12 35.23,10.21 33.43,10.21 32.82,9.6 30.38,9.6 25.65,14.34 24.23,14.34 24.23,14.33 24.2,14.33 23.98,14.54 22.96,14.54 IC3.1
TXD  (via drill 0.35)
  Top 0.152: v18.14,45.26 20.73,42.67 20.73,42.37 IC4.35 | v7.32,45.26 7.01,45.26 6.4,45.87 6.1,45.87 FTDI.4
  Bottom 0.152: v7.32,45.26 v18.14,45.26
VIN
  Top 0.152: 9.91,61.72 9.3,62.33 8.53,62.33 8.38,62.18 8.38,62.03 8.08,61.72 U2.3 7.92,61.72 6.25,63.4 3.81,63.4 C1.1 | 9.91,61.72 10.97,61.72 | 10.97,61.72 12.34,61.72 U1.3 12.5,61.72 13.11,62.33 13.72,62.33 14.33,61.72 U1.1 | 9.91,61.72 U2.1 | 10.97,61.72 10.97,63.7 J1.1

### Text on the board
tPlace: Designed by Marian Uta / PCB by Alex Heisler / v4.3